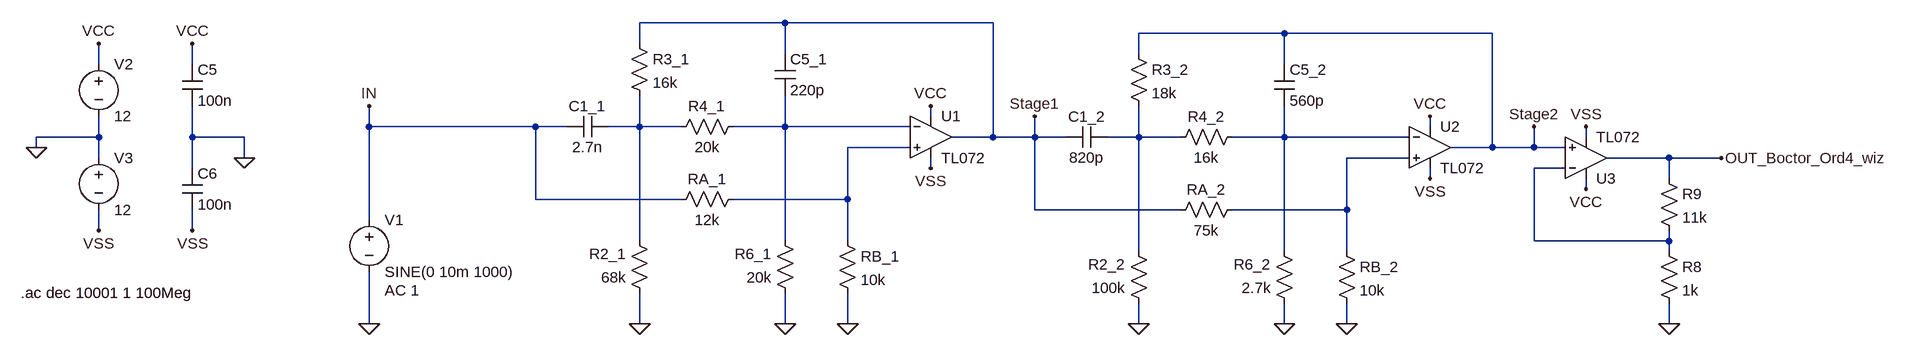
[diagram p0: schematic Boctor_ordnung4_10kHz_1dB_30dB_inv_cheby_filter-wiz.asc]
Boctor_ordnung4_10kHz_1dB_30dB_inv_cheby_filter-wiz.asc, the LTspice schematic file:
Version 4
SHEET 1 2660 736
WIRE 448 128 224 128
WIRE 768 128 448 128
WIRE 1216 144 992 144
WIRE 1536 144 1216 144
WIRE 224 160 224 128
WIRE 448 176 448 128
WIRE 992 176 992 144
WIRE -608 192 -608 160
WIRE -464 192 -464 160
WIRE 1216 192 1216 144
WIRE 672 272 672 256
WIRE -192 288 -192 256
WIRE 64 288 -192 288
WIRE 112 288 64 288
WIRE 224 288 224 240
WIRE 224 288 176 288
WIRE 288 288 224 288
WIRE 448 288 448 240
WIRE 448 288 368 288
WIRE 640 288 448 288
WIRE 1440 288 1440 272
WIRE -608 304 -608 272
WIRE -608 304 -704 304
WIRE -464 304 -464 256
WIRE -384 304 -464 304
WIRE 768 304 768 128
WIRE 768 304 704 304
WIRE 832 304 832 272
WIRE 832 304 768 304
WIRE 880 304 832 304
WIRE 992 304 992 256
WIRE 992 304 944 304
WIRE 1056 304 992 304
WIRE 1216 304 1216 256
WIRE 1216 304 1136 304
WIRE 1408 304 1216 304
WIRE 1680 304 1680 288
WIRE -704 320 -704 304
WIRE 640 320 544 320
WIRE 1536 320 1536 144
WIRE 1536 320 1472 320
WIRE 1600 320 1600 288
WIRE 1600 320 1536 320
WIRE 1648 320 1600 320
WIRE -608 336 -608 304
WIRE -384 336 -384 304
WIRE 1408 336 1312 336
WIRE 1808 336 1712 336
WIRE 1888 336 1808 336
WIRE -464 352 -464 304
WIRE 672 352 672 336
WIRE 1648 352 1600 352
WIRE 1440 368 1440 352
WIRE 1808 368 1808 336
WIRE 1680 384 1680 368
WIRE 64 400 64 288
WIRE 288 400 64 400
WIRE 544 400 544 320
WIRE 544 400 368 400
WIRE 832 416 832 304
WIRE 1056 416 832 416
WIRE 1312 416 1312 336
WIRE 1312 416 1136 416
WIRE -192 432 -192 288
WIRE -608 448 -608 416
WIRE -464 448 -464 416
WIRE 224 464 224 288
WIRE 448 464 448 288
WIRE 544 464 544 400
WIRE 1600 464 1600 352
WIRE 1808 464 1808 448
WIRE 1808 464 1600 464
WIRE 992 480 992 304
WIRE 1216 480 1216 304
WIRE 1312 480 1312 416
WIRE 1808 480 1808 464
WIRE -192 592 -192 512
WIRE 224 592 224 544
WIRE 448 592 448 544
WIRE 544 592 544 544
WIRE 992 592 992 560
WIRE 1216 592 1216 560
WIRE 1312 592 1312 560
WIRE 1808 592 1808 560
FLAG -608 160 VCC
FLAG -608 448 VSS
FLAG -704 320 0
FLAG -464 160 VCC
FLAG -464 448 VSS
FLAG -384 336 0
FLAG -192 592 0
FLAG 672 256 VCC
FLAG 672 352 VSS
FLAG 224 592 0
FLAG 448 592 0
FLAG 544 592 0
FLAG -192 256 IN
FLAG 1440 272 VCC
FLAG 1440 368 VSS
FLAG 992 592 0
FLAG 1216 592 0
FLAG 1312 592 0
FLAG 832 272 Stage1
FLAG 1808 592 0
FLAG 1680 288 VSS
FLAG 1680 384 VCC
FLAG 1888 336 OUT_Boctor_Ord4_wiz
FLAG 1600 288 Stage2
SYMBOL voltage -192 416 R0
WINDOW 123 24 124 Left 2
WINDOW 39 0 0 Left 0
SYMATTR Value2 AC 1
SYMATTR InstName V1
SYMATTR Value SINE(0 10m 1000)
SYMBOL voltage -608 176 R0
WINDOW 123 0 0 Left 0
WINDOW 39 0 0 Left 0
SYMATTR InstName V2
SYMATTR Value 12
SYMBOL voltage -608 320 R0
WINDOW 123 0 0 Left 0
WINDOW 39 0 0 Left 0
SYMATTR InstName V3
SYMATTR Value 12
SYMBOL cap -480 192 R0
SYMATTR InstName C5
SYMATTR Value 100n
SYMBOL cap -480 352 R0
SYMATTR InstName C6
SYMATTR Value 100n
SYMBOL res 208 144 R0
SYMATTR InstName R3_1
SYMATTR Value 16k
SYMBOL res 384 272 R90
WINDOW 0 0 56 VBottom 2
WINDOW 3 32 56 VTop 2
SYMATTR InstName R4_1
SYMATTR Value 20k
SYMBOL res 464 560 R180
WINDOW 0 36 76 Left 2
WINDOW 3 36 40 Left 2
SYMATTR InstName R6_1
SYMATTR Value 20k
SYMBOL res 240 560 R180
WINDOW 0 36 76 Left 2
WINDOW 3 36 40 Left 2
SYMATTR InstName R2_1
SYMATTR Value 68k
SYMBOL res 272 416 R270
WINDOW 0 32 56 VTop 2
WINDOW 3 0 56 VBottom 2
SYMATTR InstName RA_1
SYMATTR Value 12k
SYMBOL res 528 448 R0
SYMATTR InstName RB_1
SYMATTR Value 10k
SYMBOL cap 432 176 R0
SYMATTR InstName C5_1
SYMATTR Value 220p
SYMBOL cap 176 272 R90
WINDOW 0 0 32 VBottom 2
WINDOW 3 32 32 VTop 2
SYMATTR InstName C1_1
SYMATTR Value 2.7n
SYMBOL TL072 672 240 R0
SYMATTR InstName U1
SYMBOL res 976 160 R0
SYMATTR InstName R3_2
SYMATTR Value 18k
SYMBOL res 1152 288 R90
WINDOW 0 0 56 VBottom 2
WINDOW 3 32 56 VTop 2
SYMATTR InstName R4_2
SYMATTR Value 16k
SYMBOL res 1232 576 R180
WINDOW 0 36 76 Left 2
WINDOW 3 36 40 Left 2
SYMATTR InstName R6_2
SYMATTR Value 2.7k
SYMBOL res 1008 576 R180
WINDOW 0 36 76 Left 2
WINDOW 3 36 40 Left 2
SYMATTR InstName R2_2
SYMATTR Value 100k
SYMBOL res 1040 432 R270
WINDOW 0 32 56 VTop 2
WINDOW 3 0 56 VBottom 2
SYMATTR InstName RA_2
SYMATTR Value 75k
SYMBOL res 1296 464 R0
SYMATTR InstName RB_2
SYMATTR Value 10k
SYMBOL cap 1200 192 R0
SYMATTR InstName C5_2
SYMATTR Value 560p
SYMBOL cap 944 288 R90
WINDOW 0 0 32 VBottom 2
WINDOW 3 32 32 VTop 2
SYMATTR InstName C1_2
SYMATTR Value 820p
SYMBOL TL072 1440 256 R0
SYMATTR InstName U2
SYMBOL res 1792 464 R0
SYMATTR InstName R8
SYMATTR Value 1k
SYMBOL res 1792 352 R0
SYMATTR InstName R9
SYMATTR Value 11k
SYMBOL TL072 1680 400 M180
SYMATTR InstName U3
TEXT -728 544 Left 2 !.ac dec 10001 1 100Meg

The netlist it stands for:
* Boctor_ordnung4_10kHz_1dB_30dB_inv_cheby_filter-wiz.asc
V1 IN 0 SINE(0 10m 1000) AC 1
V2 VCC 0 12
V3 0 VSS 12
C5 VCC 0 100n
C6 0 VSS 100n
R3_1 Stage1 N001 16k
R4_1 N002 N001 20k
R6_1 0 N002 20k
R2_1 0 N001 68k
RA_1 IN N005 12k
RB_1 N005 0 10k
C5_1 Stage1 N002 220p
C1_1 N001 IN 2.7n
* U1: TL072 (symbol TL072 not available, pins judged from their places): In+=N005 In-=N002 V+=VCC V-=VSS OUT=Stage1
R3_2 Stage2 N003 18k
R4_2 N004 N003 16k
R6_2 0 N004 2.7k
R2_2 0 N003 100k
RA_2 Stage1 N006 75k
RB_2 N006 0 10k
C5_2 Stage2 N004 560p
C1_2 N003 Stage1 820p
* U2: TL072 (symbol TL072 not available, pins judged from their places): In+=N006 In-=N004 V+=VCC V-=VSS OUT=Stage2
R8 N007 0 1k
R9 OUT_Boctor_Ord4_wiz N007 11k
* U3: TL072 (symbol TL072 not available, pins judged from their places): In+=Stage2 In-=N007 V+=VCC V-=VSS OUT=OUT_Boctor_Ord4_wiz
.ac dec 10001 1 100Meg
.backanno
.end